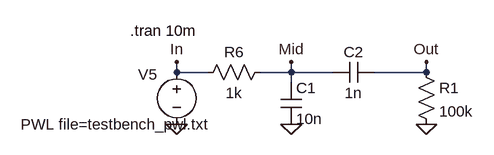
[diagram p0: schematic circuit.asc]
circuit.asc, the LTspice schematic file:
Version 4
SHEET 1 880 680
WIRE 48 176 48 160
WIRE 96 176 48 176
WIRE 224 176 224 160
WIRE 224 176 176 176
WIRE 288 176 224 176
WIRE 432 176 432 160
WIRE 432 176 352 176
WIRE 224 192 224 176
FLAG 48 256 0
FLAG 224 256 0
FLAG 432 256 0
FLAG 432 160 Out
FLAG 48 160 In
FLAG 224 160 Mid
SYMBOL res 80 192 R270
WINDOW 0 32 56 VTop 2
WINDOW 3 0 56 VBottom 2
SYMATTR InstName R6
SYMATTR Value 1k
SYMBOL voltage 48 160 R0
WINDOW 0 -45 35 Bottom 2
WINDOW 3 -95 81 Top 2
WINDOW 123 0 0 Left 0
WINDOW 39 0 0 Left 0
SYMATTR InstName V5
SYMATTR Value PWL file=testbench_pwl.txt
SYMBOL cap 208 192 R0
SYMATTR InstName C1
SYMATTR Value 10n
SYMBOL res 416 160 R0
SYMATTR InstName R1
SYMATTR Value 100k
SYMBOL cap 352 160 R90
WINDOW 0 0 32 VBottom 2
WINDOW 3 32 32 VTop 2
SYMATTR InstName C2
SYMATTR Value 1n
TEXT -24 112 Left 2 !.tran 10m

The netlist it stands for:
* circuit.asc
R6 In Mid 1k
V5 In 0 PWL file=testbench_pwl.txt
C1 Mid 0 10n
R1 Out 0 100k
C2 Out Mid 1n
.tran 10m
.backanno
.end